# Altium schematic sheet [05] Protection.SchDoc: Input Protection and Filtering
size Letter; Revision: 1.0; PageSetup: Record=PageOptions|CenterHorizontal=True|CenterVertical=True|PrintScale=1.00|XCorrection=1.00|YCorrection=1.00|PrintKind=1|BorderSize=5000000|LeftOffset=0|BottomOffset=0|Orientation=2|PaperLength=1000|PaperWidth=1000|Scale=100|PaperSource=7|PrintQuality=-3|MediaType=1|DitherType=10|PrintScaleMode=1|PaperKind=Letter|PaperIndex=1; ProjectTitle: Data Acquisition System
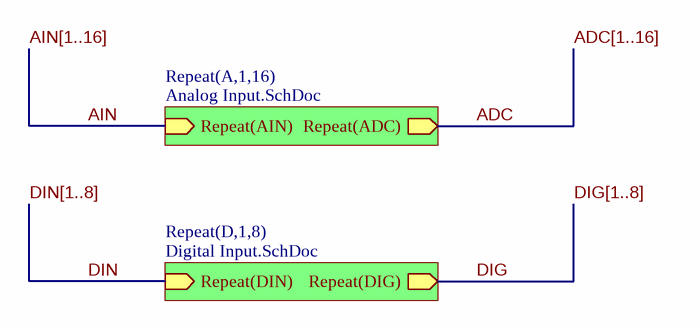
[diagram p0: [05] Protection.SchDoc]

## Sub-sheets
Repeat(A,1,16) = Analog Input.SchDoc: Repeat(AIN) (in), Repeat(ADC) (out)
Repeat(D,1,8) = Digital Input.SchDoc: Repeat(DIN) (in), Repeat(DIG) (out)

## Nets
ADC: sheet Repeat(A,1,16)/Repeat(ADC)
AIN: sheet Repeat(A,1,16)/Repeat(AIN)
DIG: sheet Repeat(D,1,8)/Repeat(DIG)
DIN: sheet Repeat(D,1,8)/Repeat(DIN)

## Buses and harness runs
bus ADC[1..16]
bus AIN[1..16]
bus DIG[1..8]
bus DIN[1..8]

## Notes on the sheet
- Date:
- Revision:
- Sheet
- of